# Altium project Nixie Valve Clock.PrjPcb (part 2 of 2)
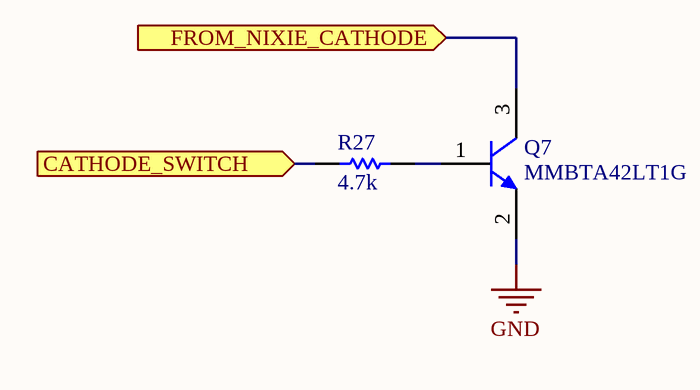
[diagram p9: IN-3 VALVE CATHODE DRIVER.SchDoc]

## Nets that join several sheets
+3V3: Nixie Valve Clock (10 pins), MCU (9 pins), VALVES/IN-14_VALVE_x2_0/IN-14 VALVE_0 (D3A.2), VALVES/IN-14_VALVE_x2_0/IN-14 VALVE_1 (D3B.2), VALVES/IN-14_VALVE_x2_1/IN-14 VALVE_0 (D3C.2), VALVES/IN-14_VALVE_x2_1/IN-14 VALVE_1 (D3D.2), VALVES/IN-14_VALVE_x2_2/IN-14 VALVE_0 (D3E.2), VALVES/IN-14_VALVE_x2_2/IN-14 VALVE_1 (D3F.2)
+100V: Nixie Valve Clock (8 pins), VALVES/IN-14 VALVE CATHODE DRIVER_0 (R22A.2), VALVES/IN-14 VALVE CATHODE DRIVER_1 (R22B.2), VALVES/IN-14 VALVE CATHODE DRIVER_2 (R22C.2), VALVES/IN-14 VALVE CATHODE DRIVER_3 (R22D.2), VALVES/IN-14 VALVE CATHODE DRIVER_4 (R22E.2), VALVES/IN-14 VALVE CATHODE DRIVER_5 (R22F.2), VALVES/IN-14 VALVE CATHODE DRIVER_6 (R22G.2), VALVES/IN-14 VALVE CATHODE DRIVER_7 (R22H.2), VALVES/IN-14 VALVE CATHODE DRIVER_8 (R22I.2), VALVES/IN-14 VALVE CATHODE DRIVER_9 (R22J.2)
+HV: Nixie Valve Clock (8 pins), VALVES/IN-14 VALVE ANODE DRIVER0 (Q3A.3 R18A.2), VALVES/IN-14 VALVE ANODE DRIVER1 (Q3B.3 R18B.2), VALVES/IN-14 VALVE ANODE DRIVER2 (Q3C.3 R18C.2), VALVES/IN-14 VALVE ANODE DRIVER3 (Q3D.3 R18D.2), VALVES/IN-14 VALVE ANODE DRIVER4 (Q3E.3 R18E.2), VALVES/IN-14 VALVE ANODE DRIVER5 (Q3F.3 R18F.2), VALVES/IN-3 VALVE_0 (R26A.2), VALVES/IN-3 VALVE_1 (R26B.2)
GND: Nixie Valve Clock (54 pins), MCU (12 pins), VALVES/IN-14 VALVE ANODE DRIVER0 (Q4A.2), VALVES/IN-14 VALVE ANODE DRIVER1 (Q4B.2), VALVES/IN-14 VALVE ANODE DRIVER2 (Q4C.2), VALVES/IN-14 VALVE ANODE DRIVER3 (Q4D.2), VALVES/IN-14 VALVE ANODE DRIVER4 (Q4E.2), VALVES/IN-14 VALVE ANODE DRIVER5 (Q4F.2), VALVES/IN-14 VALVE CATHODE DRIVER_0 (Q5A.2), VALVES/IN-14 VALVE CATHODE DRIVER_1 (Q5B.2), VALVES/IN-14 VALVE CATHODE DRIVER_2 (Q5C.2), VALVES/IN-14 VALVE CATHODE DRIVER_3 (Q5D.2), VALVES/IN-14 VALVE CATHODE DRIVER_4 (Q5E.2), VALVES/IN-14 VALVE CATHODE DRIVER_5 (Q5F.2), VALVES/IN-14 VALVE CATHODE DRIVER_6 (Q5G.2), VALVES/IN-14 VALVE CATHODE DRIVER_7 (Q5H.2), VALVES/IN-14 VALVE CATHODE DRIVER_8 (Q5I.2), VALVES/IN-14 VALVE CATHODE DRIVER_9 (Q5J.2), VALVES/IN-14_VALVE_x2_0/IN-14 VALVE_0 (Q6A.2), VALVES/IN-14_VALVE_x2_0/IN-14 VALVE_1 (Q6B.2), VALVES/IN-14_VALVE_x2_1/IN-14 VALVE_0 (Q6C.2), VALVES/IN-14_VALVE_x2_1/IN-14 VALVE_1 (Q6D.2), VALVES/IN-14_VALVE_x2_2/IN-14 VALVE_0 (Q6E.2), VALVES/IN-14_VALVE_x2_2/IN-14 VALVE_1 (Q6F.2), VALVES/IN-3 VALVE CATHODE DRIVER0 (Q7A.2), VALVES/IN-3 VALVE CATHODE DRIVER1 (Q7B.2)
!HV_SHDN: Nixie Valve Clock (J1.33 J1.34), MCU (U2.17)
ANODE_DRIVER_0: VALVES/IN-14 VALVE ANODE DRIVER0 (R20A.1), VALVES/IN-14_VALVE_x2_0/IN-14 VALVE_0 (V1A.ANODE)
ANODE_DRIVER_1: VALVES/IN-14 VALVE ANODE DRIVER1 (R20B.1), VALVES/IN-14_VALVE_x2_0/IN-14 VALVE_1 (V1B.ANODE)
ANODE_DRIVER_2: VALVES/IN-14 VALVE ANODE DRIVER2 (R20C.1), VALVES/IN-14_VALVE_x2_1/IN-14 VALVE_0 (V1C.ANODE)
ANODE_DRIVER_3: VALVES/IN-14 VALVE ANODE DRIVER3 (R20D.1), VALVES/IN-14_VALVE_x2_1/IN-14 VALVE_1 (V1D.ANODE)
ANODE_DRIVER_4: VALVES/IN-14 VALVE ANODE DRIVER4 (R20E.1), VALVES/IN-14_VALVE_x2_2/IN-14 VALVE_0 (V1E.ANODE)
ANODE_DRIVER_5: VALVES/IN-14 VALVE ANODE DRIVER5 (R20F.1), VALVES/IN-14_VALVE_x2_2/IN-14 VALVE_1 (V1F.ANODE)
AS_0: MCU (U2.11), VALVES/IN-14 VALVE ANODE DRIVER0 (R21A.1)
AS_1: MCU (U2.12), VALVES/IN-14 VALVE ANODE DRIVER1 (R21B.1)
AS_2: MCU (U2.13), VALVES/IN-14 VALVE ANODE DRIVER2 (R21C.1)
AS_3: MCU (U2.14), VALVES/IN-14 VALVE ANODE DRIVER3 (R21D.1)
AS_4: MCU (U2.22), VALVES/IN-14 VALVE ANODE DRIVER4 (R21E.1)
AS_5: MCU (U2.23), VALVES/IN-14 VALVE ANODE DRIVER5 (R21F.1)
C_0: VALVES/IN-14 VALVE CATHODE DRIVER_0 (Q5A.3 R22A.1), VALVES/IN-14_VALVE_x2_0/IN-14 VALVE_0 (V1A.0), VALVES/IN-14_VALVE_x2_0/IN-14 VALVE_1 (V1B.0), VALVES/IN-14_VALVE_x2_1/IN-14 VALVE_0 (V1C.0), VALVES/IN-14_VALVE_x2_1/IN-14 VALVE_1 (V1D.0), VALVES/IN-14_VALVE_x2_2/IN-14 VALVE_0 (V1E.0), VALVES/IN-14_VALVE_x2_2/IN-14 VALVE_1 (V1F.0)
C_1: VALVES/IN-14 VALVE CATHODE DRIVER_1 (Q5B.3 R22B.1), VALVES/IN-14_VALVE_x2_0/IN-14 VALVE_0 (V1A.1), VALVES/IN-14_VALVE_x2_0/IN-14 VALVE_1 (V1B.1), VALVES/IN-14_VALVE_x2_1/IN-14 VALVE_0 (V1C.1), VALVES/IN-14_VALVE_x2_1/IN-14 VALVE_1 (V1D.1), VALVES/IN-14_VALVE_x2_2/IN-14 VALVE_0 (V1E.1), VALVES/IN-14_VALVE_x2_2/IN-14 VALVE_1 (V1F.1)
C_2: VALVES/IN-14 VALVE CATHODE DRIVER_2 (Q5C.3 R22C.1), VALVES/IN-14_VALVE_x2_0/IN-14 VALVE_0 (V1A.2), VALVES/IN-14_VALVE_x2_0/IN-14 VALVE_1 (V1B.2), VALVES/IN-14_VALVE_x2_1/IN-14 VALVE_0 (V1C.2), VALVES/IN-14_VALVE_x2_1/IN-14 VALVE_1 (V1D.2), VALVES/IN-14_VALVE_x2_2/IN-14 VALVE_0 (V1E.2), VALVES/IN-14_VALVE_x2_2/IN-14 VALVE_1 (V1F.2)
C_3: VALVES/IN-14 VALVE CATHODE DRIVER_3 (Q5D.3 R22D.1), VALVES/IN-14_VALVE_x2_0/IN-14 VALVE_0 (V1A.3), VALVES/IN-14_VALVE_x2_0/IN-14 VALVE_1 (V1B.3), VALVES/IN-14_VALVE_x2_1/IN-14 VALVE_0 (V1C.3), VALVES/IN-14_VALVE_x2_1/IN-14 VALVE_1 (V1D.3), VALVES/IN-14_VALVE_x2_2/IN-14 VALVE_0 (V1E.3), VALVES/IN-14_VALVE_x2_2/IN-14 VALVE_1 (V1F.3)
C_4: VALVES/IN-14 VALVE CATHODE DRIVER_4 (Q5E.3 R22E.1), VALVES/IN-14_VALVE_x2_0/IN-14 VALVE_0 (V1A.4), VALVES/IN-14_VALVE_x2_0/IN-14 VALVE_1 (V1B.4), VALVES/IN-14_VALVE_x2_1/IN-14 VALVE_0 (V1C.4), VALVES/IN-14_VALVE_x2_1/IN-14 VALVE_1 (V1D.4), VALVES/IN-14_VALVE_x2_2/IN-14 VALVE_0 (V1E.4), VALVES/IN-14_VALVE_x2_2/IN-14 VALVE_1 (V1F.4)
C_5: VALVES/IN-14 VALVE CATHODE DRIVER_5 (Q5F.3 R22F.1), VALVES/IN-14_VALVE_x2_0/IN-14 VALVE_0 (V1A.5), VALVES/IN-14_VALVE_x2_0/IN-14 VALVE_1 (V1B.5), VALVES/IN-14_VALVE_x2_1/IN-14 VALVE_0 (V1C.5), VALVES/IN-14_VALVE_x2_1/IN-14 VALVE_1 (V1D.5), VALVES/IN-14_VALVE_x2_2/IN-14 VALVE_0 (V1E.5), VALVES/IN-14_VALVE_x2_2/IN-14 VALVE_1 (V1F.5)
C_6: VALVES/IN-14 VALVE CATHODE DRIVER_6 (Q5G.3 R22G.1), VALVES/IN-14_VALVE_x2_0/IN-14 VALVE_0 (V1A.6), VALVES/IN-14_VALVE_x2_0/IN-14 VALVE_1 (V1B.6), VALVES/IN-14_VALVE_x2_1/IN-14 VALVE_0 (V1C.6), VALVES/IN-14_VALVE_x2_1/IN-14 VALVE_1 (V1D.6), VALVES/IN-14_VALVE_x2_2/IN-14 VALVE_0 (V1E.6), VALVES/IN-14_VALVE_x2_2/IN-14 VALVE_1 (V1F.6)
C_7: VALVES/IN-14 VALVE CATHODE DRIVER_7 (Q5H.3 R22H.1), VALVES/IN-14_VALVE_x2_0/IN-14 VALVE_0 (V1A.7), VALVES/IN-14_VALVE_x2_0/IN-14 VALVE_1 (V1B.7), VALVES/IN-14_VALVE_x2_1/IN-14 VALVE_0 (V1C.7), VALVES/IN-14_VALVE_x2_1/IN-14 VALVE_1 (V1D.7), VALVES/IN-14_VALVE_x2_2/IN-14 VALVE_0 (V1E.7), VALVES/IN-14_VALVE_x2_2/IN-14 VALVE_1 (V1F.7)
C_8: VALVES/IN-14 VALVE CATHODE DRIVER_8 (Q5I.3 R22I.1), VALVES/IN-14_VALVE_x2_0/IN-14 VALVE_0 (V1A.8), VALVES/IN-14_VALVE_x2_0/IN-14 VALVE_1 (V1B.8), VALVES/IN-14_VALVE_x2_1/IN-14 VALVE_0 (V1C.8), VALVES/IN-14_VALVE_x2_1/IN-14 VALVE_1 (V1D.8), VALVES/IN-14_VALVE_x2_2/IN-14 VALVE_0 (V1E.8), VALVES/IN-14_VALVE_x2_2/IN-14 VALVE_1 (V1F.8)
C_9: VALVES/IN-14 VALVE CATHODE DRIVER_9 (Q5J.3 R22J.1), VALVES/IN-14_VALVE_x2_0/IN-14 VALVE_0 (V1A.9), VALVES/IN-14_VALVE_x2_0/IN-14 VALVE_1 (V1B.9), VALVES/IN-14_VALVE_x2_1/IN-14 VALVE_0 (V1C.9), VALVES/IN-14_VALVE_x2_1/IN-14 VALVE_1 (V1D.9), VALVES/IN-14_VALVE_x2_2/IN-14 VALVE_0 (V1E.9), VALVES/IN-14_VALVE_x2_2/IN-14 VALVE_1 (V1F.9)
CS_0: Nixie Valve Clock (U1.3), VALVES/IN-14 VALVE CATHODE DRIVER_0 (R23A.1)
CS_1: Nixie Valve Clock (U1.14), VALVES/IN-14 VALVE CATHODE DRIVER_1 (R23B.1)
CS_2: Nixie Valve Clock (U1.2), VALVES/IN-14 VALVE CATHODE DRIVER_2 (R23C.1)
CS_3: Nixie Valve Clock (U1.15), VALVES/IN-14 VALVE CATHODE DRIVER_3 (R23D.1)
CS_4: Nixie Valve Clock (U1.1), VALVES/IN-14 VALVE CATHODE DRIVER_4 (R23E.1)
CS_5: Nixie Valve Clock (U1.6), VALVES/IN-14 VALVE CATHODE DRIVER_5 (R23F.1)
CS_6: Nixie Valve Clock (U1.7), VALVES/IN-14 VALVE CATHODE DRIVER_6 (R23G.1)
CS_7: Nixie Valve Clock (U1.4), VALVES/IN-14 VALVE CATHODE DRIVER_7 (R23H.1)
CS_8: Nixie Valve Clock (U1.9), VALVES/IN-14 VALVE CATHODE DRIVER_8 (R23I.1)
CS_9: Nixie Valve Clock (U1.5), VALVES/IN-14 VALVE CATHODE DRIVER_9 (R23J.1)
FAULT: Nixie Valve Clock (J1.37 J1.38), MCU (U2.16)
IN-3_CATHODE_0: VALVES/IN-3 VALVE_0 (V2A.2), VALVES/IN-3 VALVE CATHODE DRIVER0 (Q7A.3)
IN-3_CATHODE_1: VALVES/IN-3 VALVE_1 (V2B.2), VALVES/IN-3 VALVE CATHODE DRIVER1 (Q7B.3)
IN-3_SW_0: MCU (U2.27), VALVES/IN-3 VALVE CATHODE DRIVER0 (R27A.1)
IN-3_SW_1: MCU (U2.28), VALVES/IN-3 VALVE CATHODE DRIVER1 (R27B.1)
T_L_SW_0: MCU (U2.18), VALVES/IN-14_VALVE_x2_0/IN-14 VALVE_0 (R25A.1), VALVES/IN-14_VALVE_x2_0/IN-14 VALVE_1 (R25B.1)
T_L_SW_1: MCU (U2.19), VALVES/IN-14_VALVE_x2_1/IN-14 VALVE_0 (R25C.1), VALVES/IN-14_VALVE_x2_1/IN-14 VALVE_1 (R25D.1)
T_L_SW_2: MCU (U2.21), VALVES/IN-14_VALVE_x2_2/IN-14 VALVE_0 (R25E.1), VALVES/IN-14_VALVE_x2_2/IN-14 VALVE_1 (R25F.1)

## Assembly variants
Various DNF Variant of Nixie Valve Clock: not fitted C? C? R? R? R? R? R? V1A V1B V1C V1D V1E V1F V2A V2B